# Altium schematic sheet RSD_M1_HELMET_UNIT_POWER_V2.SchDoc
size A2
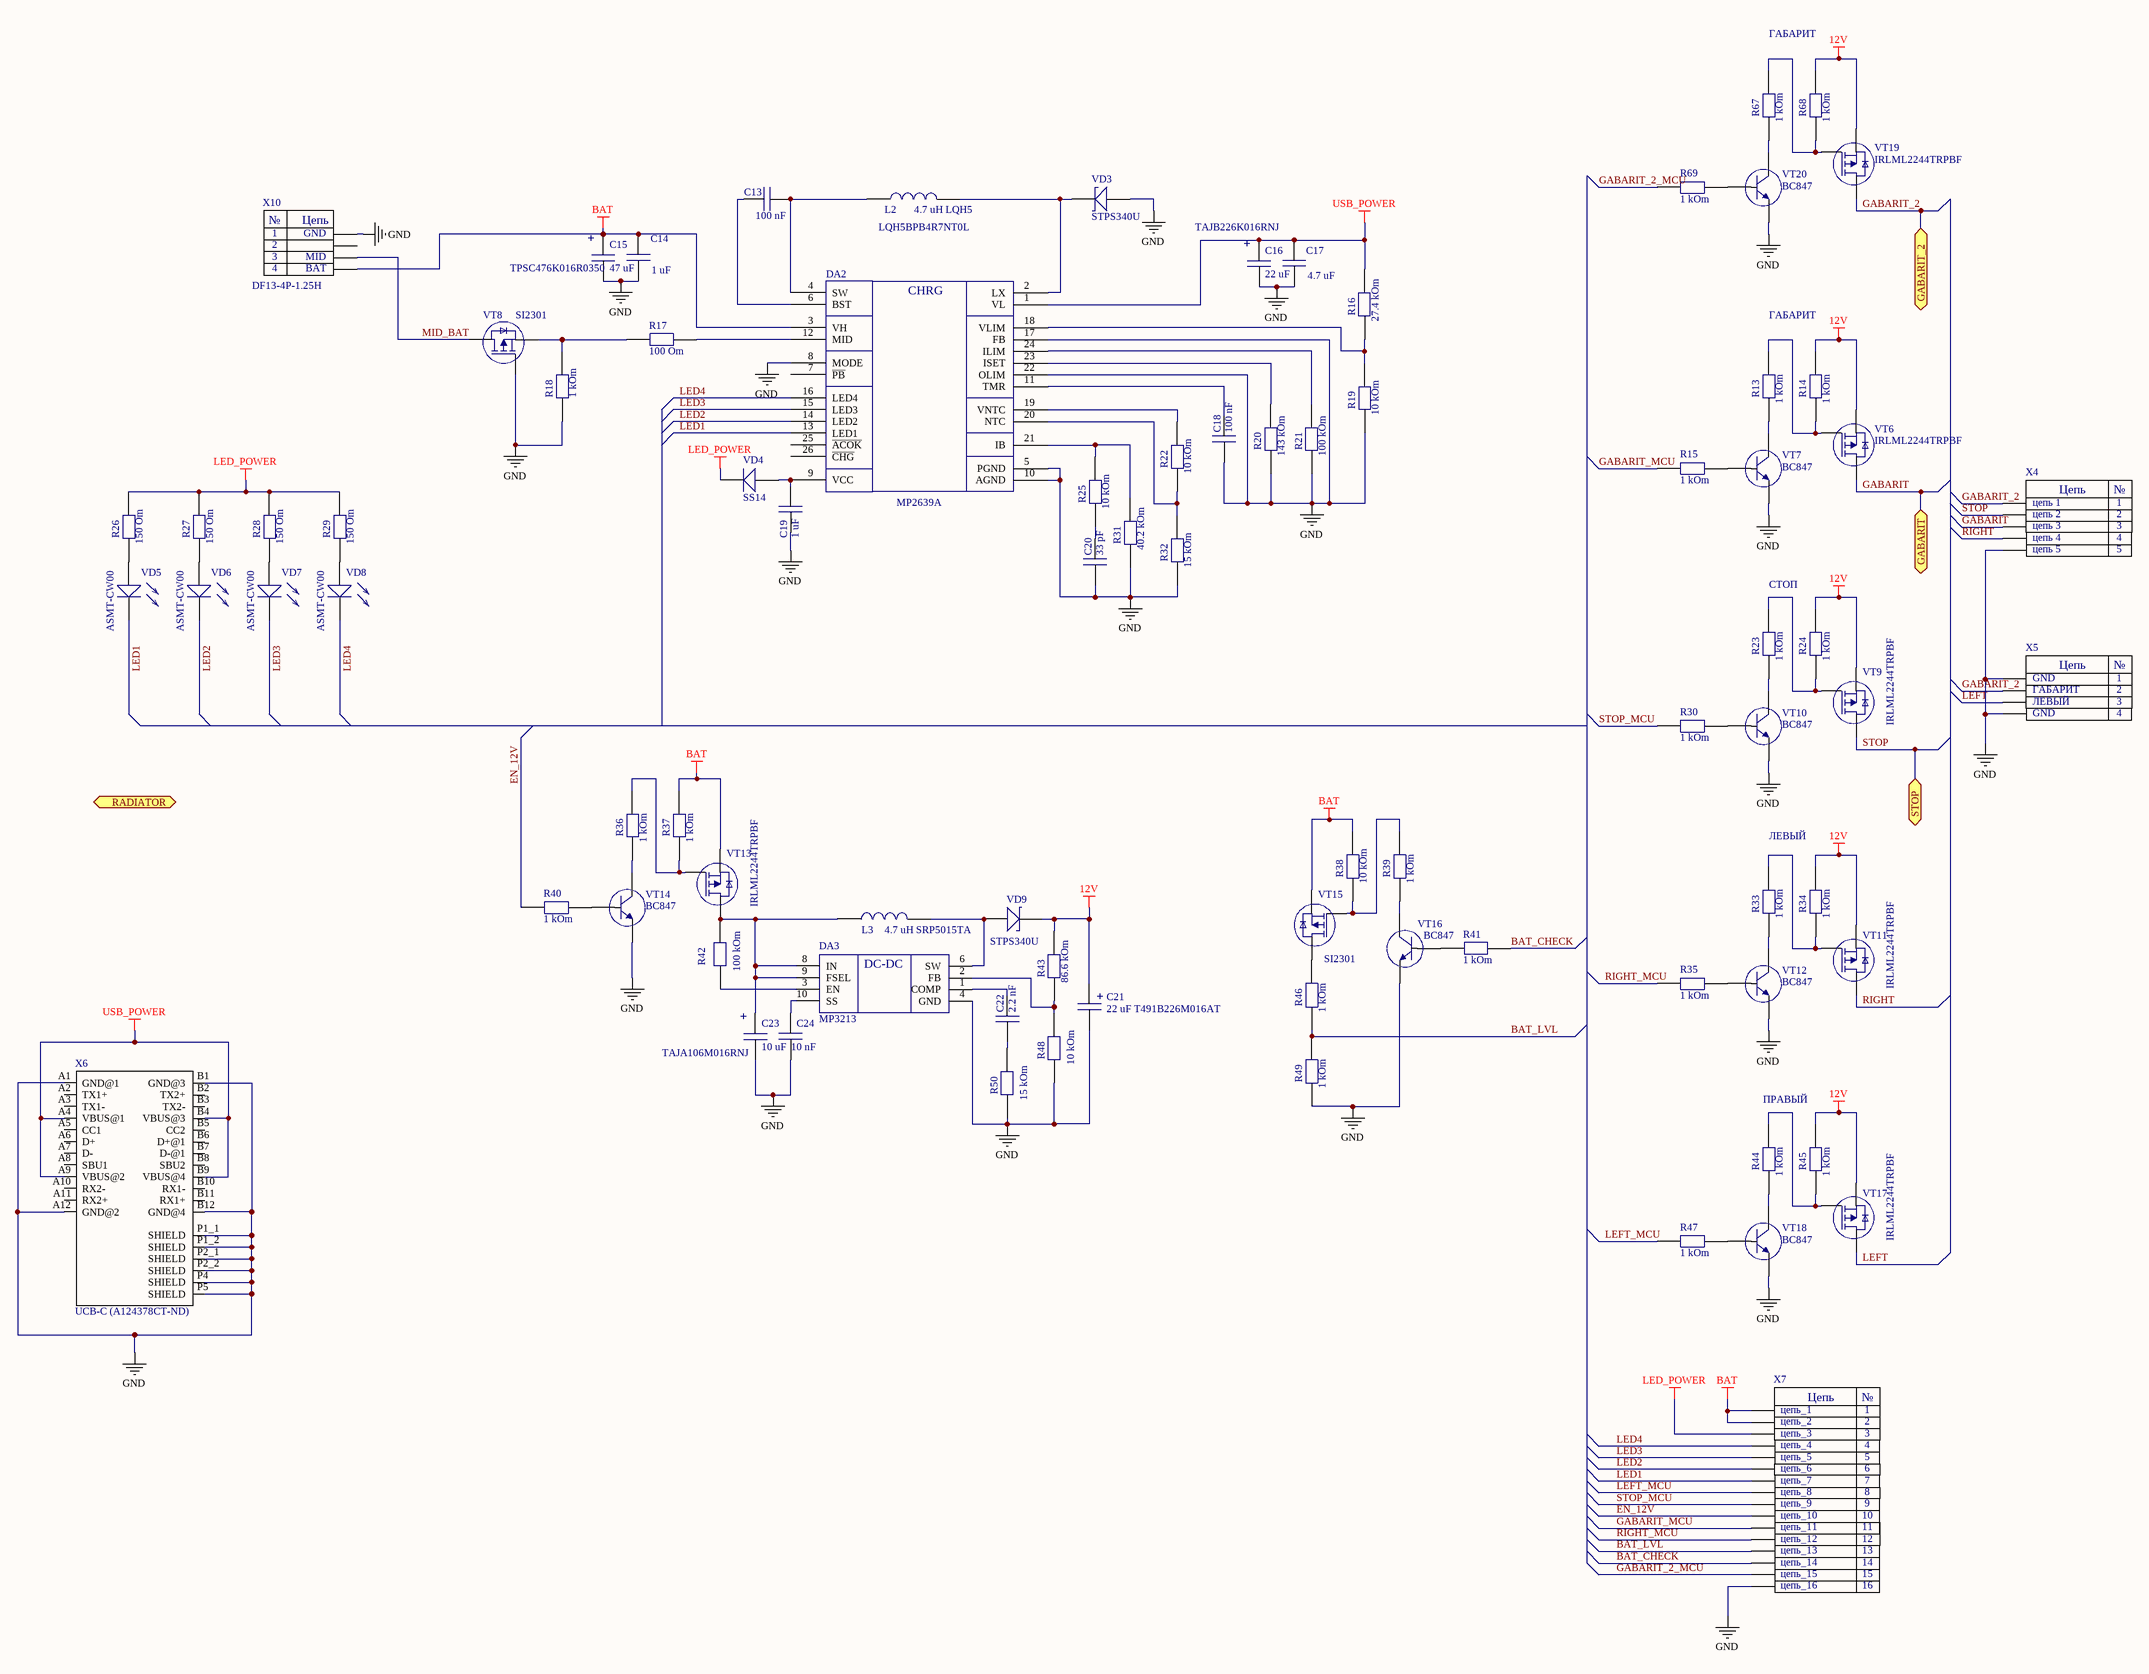
[diagram p0: RSD_M1_HELMET_UNIT_POWER_V2.SchDoc]

## Parts
C13  value 100 nF  [CAP0603]  (hidden comment: Capacitor)
C14  value 1 uF  [CAP0603]  (hidden comment: Capacitor)
C15  47 uF  value TPSC476K016R0350  [tantal_case_B]
C16  22 uF  value TAJB226K016RNJ  [tantal_case_B]
C17  value 4.7 uF  [CAP0603]  (hidden comment: Capacitor)
C18  value 100 nF  [CAP0603]  (hidden comment: Capacitor)
C19  value 1 uF  [CAP0603]  (hidden comment: Capacitor)
C20  value 33 pF  [CAP0603]  (hidden comment: Capacitor)
C21  value 22 uF T491B226M016AT  [tantal_case_B]  (hidden comment: Capacitor_Polar)
C22  value 2.2 nF  [CAP0603]  (hidden comment: Capacitor)
C23  10 uF  value TAJA106M016RNJ  [tantal_case_A]
C24  value 10 nF  [CAP0603]  (hidden comment: Capacitor)
DA2  value MP2639A  [MP2639]  (hidden comment: MP2639)
DA3  MP3213  [MP3213]
L2  value 4.7 uH LQH5  PN: LQH5BPB4R7NT0L  [LQH5BP]  (hidden comment: coil)
L3  value 4.7 uH SRP5015TA  [inductor_SRP5015TA]  (hidden comment: coil)
R13  value 1 kOm  [Res0603]  (hidden comment: Resistor)
R14  value 1 kOm  [Res0603]  (hidden comment: Resistor)
R15  value 1 kOm  [Res0603]  (hidden comment: Resistor)
R16  value 27.4 kOm  [Res0603]  (hidden comment: Resistor)
R17  value 100 Om  [Res0603]  (hidden comment: Resistor)
R18  value 1 kOm  [Res0603]  (hidden comment: Resistor)
R19  value 10 kOm  [Res0603]  (hidden comment: Resistor)
R20  value 143 kOm  [Res0603]  (hidden comment: Resistor)
R21  value 100 kOm  [Res0603]  (hidden comment: Resistor)
R22  value 10 kOm  [Res0603]  (hidden comment: Resistor)
R23  value 1 kOm  [Res0603]  (hidden comment: Resistor)
R24  value 1 kOm  [Res0603]  (hidden comment: Resistor)
R25  value 10 kOm  [Res0603]  (hidden comment: Resistor)
R26  value 150 Om  [Res0603]  (hidden comment: Resistor)
R27  value 150 Om  [Res0603]  (hidden comment: Resistor)
R28  value 150 Om  [Res0603]  (hidden comment: Resistor)
R29  value 150 Om  [Res0603]  (hidden comment: Resistor)
R30  value 1 kOm  [Res0603]  (hidden comment: Resistor)
R31  value 40.2 kOm  [Res0603]  (hidden comment: Resistor)
R32  value 15 kOm  [Res0603]  (hidden comment: Resistor)
R33  value 1 kOm  [Res0603]  (hidden comment: Resistor)
R34  value 1 kOm  [Res0603]  (hidden comment: Resistor)
R35  value 1 kOm  [Res0603]  (hidden comment: Resistor)
R36  value 1 kOm  [Res0603]  (hidden comment: Resistor)
R37  value 1 kOm  [Res0603]  (hidden comment: Resistor)
R38  value 10 kOm  [Res0603]  (hidden comment: Resistor)
R39  value 1 kOm  [Res0603]  (hidden comment: Resistor)
R40  value 1 kOm  [Res0603]  (hidden comment: Resistor)
R41  value 1 kOm  [Res0603]  (hidden comment: Resistor)
R42  value 100 kOm  [Res0603]  (hidden comment: Resistor)
R43  value 86.6 kOm  [Res0603]  (hidden comment: Resistor)
R44  value 1 kOm  [Res0603]  (hidden comment: Resistor)
R45  value 1 kOm  [Res0603]  (hidden comment: Resistor)
R46  value 1 kOm  [Res0603]  (hidden comment: Resistor)
R47  value 1 kOm  [Res0603]  (hidden comment: Resistor)
R48  value 10 kOm  [Res0603]  (hidden comment: Resistor)
R49  value 1 kOm  [Res0603]  (hidden comment: Resistor)
R50  value 15 kOm  [Res0603]  (hidden comment: Resistor)
R67  value 1 kOm  [Res0603]  (hidden comment: Resistor)
R68  value 1 kOm  [Res0603]  (hidden comment: Resistor)
R69  value 1 kOm  [Res0603]  (hidden comment: Resistor)
VD3  value STPS340U  [SMB1]  (hidden comment: Schottky)
VD4  value SS14  [SMA-F]  (hidden comment: Diode)
VD5  value ASMT-CW00  [LED 0603]  (hidden comment: LED)
VD6  value ASMT-CW00  [LED 0603]  (hidden comment: LED)
VD7  value ASMT-CW00  [LED 0603]  (hidden comment: LED)
VD8  value ASMT-CW00  [LED 0603]  (hidden comment: LED)
VD9  value STPS340U  [SMB1]  (hidden comment: Schottky)
VT6  value IRLML2244TRPBF  [SOT 23]  (hidden comment: MOSFET-P)
VT7  value BC847  [SOT 23]  (hidden comment: NPN)
VT8  value SI2301  [SOT 23]  (hidden comment: MOSFET-P)
VT9  value IRLML2244TRPBF  [SOT 23]  (hidden comment: MOSFET-P)
VT10  value BC847  [SOT 23]  (hidden comment: NPN)
VT11  value IRLML2244TRPBF  [SOT 23]  (hidden comment: MOSFET-P)
VT12  value BC847  [SOT 23]  (hidden comment: NPN)
VT13  value IRLML2244TRPBF  [SOT 23]  (hidden comment: MOSFET-P)
VT14  value BC847  [SOT 23]  (hidden comment: NPN)
VT15  value SI2301  [SOT 23]  (hidden comment: MOSFET-P)
VT16  value BC847  [SOT 23]  (hidden comment: NPN)
VT17  value IRLML2244TRPBF  [SOT 23]  (hidden comment: MOSFET-P)
VT18  value BC847  [SOT 23]  (hidden comment: NPN)
VT19  value IRLML2244TRPBF  [SOT 23]  (hidden comment: MOSFET-P)
VT20  value BC847  [SOT 23]  (hidden comment: NPN)
X4  1: цепь 1  2: цепь 2  3: цепь 3  4: цепь 4  5: цепь 5  [FPC_5_1]  (hidden comment: FPC_connector_5_1)
X5  1: GND  2: ГАБАРИТ  3: ЛЕВЫЙ  [FPC_4_1]  (hidden comment: FPC_connector_4_1)
X6  value UCB-C (A124378CT-ND)  [USB-C]  (hidden comment: UCB-C)
X7  16: цепь_16  1: цепь_1  2: цепь_2  3: цепь_3  4: цепь_4  5: цепь_5  6: цепь_6  7: цепь_7  8: цепь_8  9: цепь_9  10: цепь_10  11: цепь_11  12: цепь_12  13: цепь_13  14: цепь_14  15: цепь_15  [FPC_16_0.5]  (hidden comment: FPC_connector_16)
X10  value DF13-4P-1.25H  1: GND  3: MID  4: BAT  [bat_conn]  (hidden comment: BATTERY)

## Ports
GABARIT, GABARIT_2, RADIATOR, STOP

## Nets
12V: C21.1 R14.2 R24.2 R34.2 R43.1 R45.2 R68.2 VD9.1 VT6.S VT9.S VT11.S VT17.S VT19.S
BAT: C14.2 C15.1 DA2.3(VH) R37.2 R38.2 VT13.S VT15.S X7.1 X7.2 X10.4
GND: C14.1 C15.2 C16.2 C17.1 C18.1 C19.1 C20.1 C21.2 C23.2 C24.1 DA2.5(PGND) DA2.8(MODE) DA2.10(AGND) DA2.17(FB) DA2.22(OLIM) DA3.4(GND) R18.1 R19.1 R20.1 R21.2 R31.1 R32.1 R48.2 R49.1 R50.2 VD3.2 VT7.E VT8.G VT10.E VT12.E VT14.E VT16.E VT18.E VT20.E X4.5 X5.1 X5.4 X6.A1(GND@1) X6.A12(GND@2) X6.B1(GND@3) X6.B12(GND@4) X6.P1_1(SHIELD) X6.P1_2(SHIELD) X6.P2_1(SHIELD) X6.P2_2(SHIELD) X6.P4(SHIELD) X6.P5(SHIELD) X7.16 X10.1
LED_POWER: R26.2 R27.2 R28.2 R29.2 VD4.1 X7.3
USB_POWER: C16.1 C17.2 DA2.1(VL) R16.1 X6.A4(VBUS@1) X6.A9(VBUS@2) X6.B4(VBUS@3) X6.B9(VBUS@4)
BAT_CHECK: R41.2 X7.14
BAT_LVL: R46.1 R49.2 X7.13
EN_12V: R40.2 X7.10
GABARIT: VT6.D X4.3 ; port GABARIT
GABARIT_2: VT19.D X4.1 X5.2 ; port GABARIT_2
GABARIT_2_MCU: R69.2 X7.15
GABARIT_MCU: R15.2 X7.11
LED1: DA2.13(LED1) VD5.1 X7.7
LED2: DA2.14(LED2) VD6.1 X7.6
LED3: DA2.15(LED3) VD7.1 X7.5
LED4: DA2.16(LED4) VD8.1 X7.4
LEFT: VT17.D X5.3
LEFT_MCU: R47.2 X7.8
MID_BAT: VT8.D X10.3
RIGHT: VT11.D X4.4
RIGHT_MCU: R35.2 X7.12
STOP: VT9.D X4.2 ; port STOP
STOP_MCU: R30.2 X7.9
NetC13_1: C13.1 DA2.6(BST)
NetC13_2: C13.2 DA2.4(SW) L2.1
NetC18_2: C18.2 DA2.11(TMR)
NetC19_2: C19.2 DA2.9(VCC) VD4.2
NetC20_2: C20.2 R25.1
NetC22_1: C22.1 DA3.1(COMP)
NetC22_2: C22.2 R50.1
NetC23_1: C23.1 DA3.8(IN) DA3.9(FSEL) L3.1 R42.1 VT13.D
NetC24_2: C24.2 DA3.10(SS)
NetDA2_2: DA2.2(LX) L2.2 VD3.1
NetDA2_12: DA2.12(MID) R17.2
NetDA2_18: DA2.18(VLIM) R16.2 R19.2
NetDA2_19: DA2.19(VNTC) R22.2
NetDA2_20: DA2.20(NTC) R22.1 R32.2
NetDA2_21: DA2.21(IB) R25.2 R31.2
NetDA2_23: DA2.23(ISET) R20.2
NetDA2_24: DA2.24(ILIM) R21.1
NetDA3_2: DA3.2(FB) R43.2 R48.1
NetDA3_3: DA3.3(EN) R42.2
NetDA3_6: DA3.6(SW) L3.2 VD9.2
NetR13_1: R13.1 VT7.K
NetR13_2: R13.2 R14.1 VT6.G
NetR15_1: R15.1 VT7.B
NetR17_1: R17.1 R18.2 VT8.S
NetR23_1: R23.1 VT10.K
NetR23_2: R23.2 R24.1 VT9.G
NetR26_1: R26.1 VD5.2
NetR27_1: R27.1 VD6.2
NetR28_1: R28.1 VD7.2
NetR29_1: R29.1 VD8.2
NetR30_1: R30.1 VT10.B
NetR33_1: R33.1 VT12.K
NetR33_2: R33.2 R34.1 VT11.G
NetR35_1: R35.1 VT12.B
NetR36_1: R36.1 VT14.K
NetR36_2: R36.2 R37.1 VT13.G
NetR38_1: R38.1 R39.2 VT15.G
NetR39_1: R39.1 VT16.K
NetR40_1: R40.1 VT14.B
NetR41_1: R41.1 VT16.B
NetR44_1: R44.1 VT18.K
NetR44_2: R44.2 R45.1 VT17.G
NetR46_2: R46.2 VT15.D
NetR47_1: R47.1 VT18.B
NetR67_1: R67.1 VT20.K
NetR67_2: R67.2 R68.1 VT19.G
NetR69_1: R69.1 VT20.B

Not connected (* = marked no-connect by the designer): DA2 7(~{PB}) 25(~{ACOK}) 26(~{CHG}); X6 A2(TX1+) A3(TX1-) A5(CC1) A6(D+) A7(D-) A8(SBU1) A10(RX2-) A11(RX2+) B2(TX2+) B3(TX2-) B5(CC2) B6(D+@1) B7(D-@1) B8(SBU2) B10(RX1-) B11(RX1+); X10 2

## Notes on the sheet
- ГАБАРИТ
- СТОП
- ЛЕВЫЙ
- ПРАВЫЙ
- (in symbol Capacitor_Polar) +
- (in symbol FPC_connector_4_1) Цепь; №
- (in symbol FPC_connector_5_1) Цепь; №
- (in symbol FPC_connector_16) Цепь; №
- (in symbol MP2639) CHRG
- (in symbol MP3213) DC-DC
- (in symbol SWDIO) №; Цепь

## Library data of the parts
C15 C16 C23 = Capacitor_Polar
VT6 VT8 VT9 VT11 VT13 VT15 VT17 VT19 = MOSFET-P: pin to pad: D>3 G>1 S>2
VT7 VT10 VT12 VT14 VT16 VT18 VT20 = NPN: pin to pad: B>1 E>2 K>3
X4 = FPC_connector_5_1: Value: 0522070560
X5 = FPC_connector_4_1: Value: 0522070433; 4: GND
X7 = FPC_connector_16: Value: 0527461671
X10 = SWDIO
DA3 = MP3213: Value: MP3213